# Altium schematic sheet MotorDriver.SchDoc
size A4; SheetNumber: 5; SheetTotal: 6
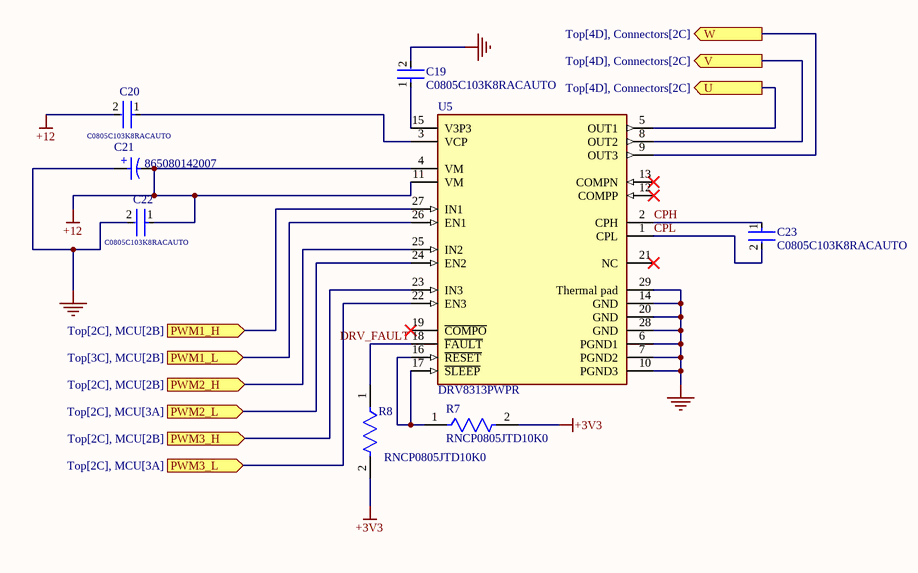
[diagram p0: MotorDriver.SchDoc]

## Parts
C19  C0805C103K8RACAUTO  [FP-C0805C103K8RACAUTO-MFG]
C20  C0805C103K8RACAUTO  [FP-C0805C103K8RACAUTO-MFG]
C21  865080142007  [WCAP-ASLI_D5H5.5]
C22  C0805C103K8RACAUTO  [FP-C0805C103K8RACAUTO-MFG]
C23  C0805C103K8RACAUTO  [FP-C0805C103K8RACAUTO-MFG]
R7  RNCP0805JTD10K0  [FP-RNCP0805-IPC_B]
R8  RNCP0805JTD10K0  [FP-RNCP0805-IPC_B]
U5  DRV8313PWPR  [FP-PWP0028C-IPC_B]

## Ports
PWM1_H (in, see Top[2C], MCU[2B]), PWM1_L (in, see Top[3C], MCU[2B]), PWM2_H (in, see Top[2C], MCU[2B]), PWM2_L (in, see Top[2C], MCU[3A]), PWM3_H (in, see Top[2C], MCU[2B]), PWM3_L (in, see Top[2C], MCU[3A]), U (out, see Top[4D], Connectors[2C]), V (out, see Top[4D], Connectors[2C]), W (out, see Top[4D], Connectors[2C])

## Nets
+3V3: R7.2 R8.2
+12: C20.2 C21.2(N) C22.1 U5.4(VM) U5.11(VM)
NetC19_2: C19.2 C21.1(P) C22.2 U5.6(PGND1) U5.7(PGND2) U5.10(PGND3) U5.14(GND) U5.20(GND) U5.28(GND) U5.29(Thermal_pad)
CPH: C23.1 U5.2(CPH)
CPL: C23.2 U5.1(CPL)
DRV_FAULT: R8.1 U5.18(~{FAULT})
PWM1_H: U5.27(IN1) ; port PWM1_H
PWM1_L: U5.26(EN1) ; port PWM1_L
PWM2_H: U5.25(IN2) ; port PWM2_H
PWM2_L: U5.24(EN2) ; port PWM2_L
PWM3_H: U5.23(IN3) ; port PWM3_H
PWM3_L: U5.22(EN3) ; port PWM3_L
U: U5.5(OUT1) ; port U
V: U5.8(OUT2) ; port V
W: U5.9(OUT3) ; port W
NetC19_1: C19.1 U5.15(V3P3)
NetC20_1: C20.1 U5.3(VCP)
NetR7_1: R7.1 U5.16(~{RESET}) U5.17(~{SLEEP})

Not connected (* = marked no-connect by the designer): U5 12(COMPP)* 13(COMPN)* 19(~{COMPO})* 21(NC)*

## Notes on the sheet
- (in symbol CMP-03913-53914538-2) +

## Library data of the parts
C19 C20 C22 C23 = CMP-00212-126448506-1: C0805C103K8RACAUTO Cap, 0.01UF, 10V, Mlcc, 0805 Rohs Compliant: Yes; Material: Ceramic; Capacitance: 10nF; Dielectric: X7R; Tolerance: 10%; Height: 880µm; NexarPartId: 126448506; Voltage Rating: 10V; Voltage Rating (DC): 10V; Min Operating Temperature: -55°C; Max Operating Temperature: 125°C; Case/Package: 0805; RoHS: Compliant
C21 = CMP-03913-53914538-2: Alum. Electrolytic Cap 100UF 25V 5MMV-CHIP Wcap-asli, Lifetime 2000H +105OC; Voltage Rating: 6.3V; Life (Hours): 2000hours; Ripple Current: 170mA; Polarity: Polar; Tolerance: 20%; Leakage Current: 6.3µA; Impedance: 800mΩ; Insulation Resistance: 1MΩ; Capacitance: 100µF; ESR (Equivalent Series Resistance): 699.36mΩ; Height - Seated (Max): 5.5118mm; Voltage Rating (DC): 6.3V; Max Operating Temperature: 105°C; Case/Package: Radial; Mount: Surface Mount; Diameter: 5mm; Length: 5.5mm; Ripple Current (AC): 170mA; RoHS: Compliant; REACH SVHC: Unknown; Height: 5.5mm; Width: 5.3mm; Min Operating Temperature: -55°C
R7 R8 = CMP-26527-002868-1: 10kΩ ±5% 0.25W 0805 High Power Anti-Sulfur Thin Film Chip Resistor; Max Operating Temperature: 155°C; Min Operating Temperature: -55°C; Mount: Surface Mount; Tolerance: 5%; RoHS Compliant: Yes
U5 = CMP-04915-000025-1: IC MOTOR DRIVER 8V-60V 28HTSSOP; Min Supply Voltage: 8V; Max Supply Voltage: 60V; Interface: Parallel; Output Current: 1.75A; Number of Outputs: 1; Logic Function: AND GATE; Package Quantity: 2000; Number of Pins: 28; Case/Package: HTSSOP; Min Operating Temperature: -40°C; Mount: Surface Mount; Series: -; Packaging: Tape and Reel; Max Operating Temperature: 125°C; Lead Free: Lead Free